# Altium schematic sheet SmartCage.SchDoc: Loadcell Interface
size Legal; ENG_APP_DATE: --/--/--; DSN_APP_DATE: --/--/--; CHK_APP_DATE: --/--/--; DrawnBy: Maxime Tousignant-Tremblay; Organization: DCC/M Lab; DocumentNumber: SC-LI-REV1; Revision: 1; SheetNumber: 1; SheetTotal: 1; Units: mm; Security: CAN UNCLASSIFIED
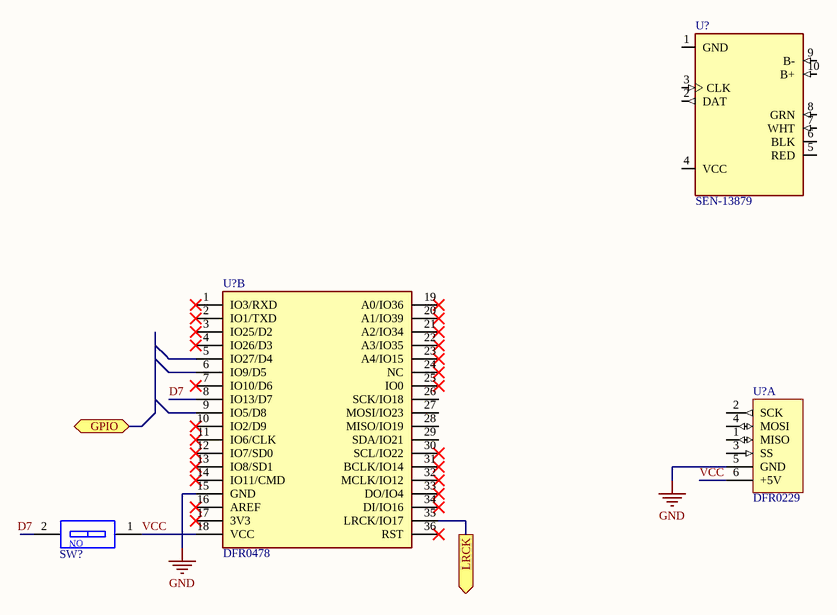
[diagram p0: SmartCage.SchDoc]

## Parts
(Parts that share a designator on the sheet are numbered #1, #2 ... from top to bottom, then left to right.)
SW?  418117270901  [418117270901]  (value not drawn)
U?#1  SEN-13879  [SEN-13879-Footprint-1]
U?#2  DFR0229  [DFR0229-Footprint-1]  (part A of 2)
U?#3  DFR0478  [DFR0478-Footprint-1]  (part B of 2)

## Ports
GPIO (bidir), LRCK (out)

## Nets
GND: U?#2.5(GND) U?#3.15(GND)
D7: SW?.2 U?#3.8(IO13/D7)
LRCK: U?#3.35(LRCK/IO17) ; port LRCK
VCC: SW?.1 U?#2.6(+5V) U?#3.18(VCC)

Not connected (* = marked no-connect by the designer): U?#1 1(GND) 2(DAT) 3(CLK) 4(VCC) 5(RED) 6(BLK) 7(WHT) 8(GRN) 9(B-) 10(B+); U?#2 1(MISO) 2(SCK) 3(SS) 4(MOSI); U?#3 1(IO3/RXD)* 2(IO1/TXD)* 3(IO25/D2)* 4(IO26/D3)* 5(IO27/D4) 6(IO9/D5) 7(IO10/D6)* 9(IO5/D8) 10(IO2/D9)* 11(IO6/CLK)* 12(IO7/SD0)* 13(IO8/SD1)* 14(IO11/CMD)* 16(AREF)* 17(3V3)* 19(A0/IO36)* 20(A1/IO39)* 21(A2/IO34)* 22(A3/IO35)* 23(A4/IO15)* 24(NC)* 25(IO0)* 26(SCK/IO18) 27(MOSI/IO23) 28(MISO/IO19) 29(SDA/IO21) 30(SCL/IO22)* 31(BCLK/IO14)* 32(MCLK/IO12)* 33(DO/IO4)* 34(DI/IO16)* 36(RST)*

## Notes on the sheet
- DRAWN BY
- PROJECT
- DATE
- LAB
- DRAWING NO
- TITLE
- UNITS
- REV
- SHEET
- OF
- (in symbol CMP-011-00014-1) ON

## Library data of the parts
SW? = CMP-011-00014-1: Slide Dip Switch, 1 Switches, SPST, Off-on, Latched, 0.025A, 24VDC, 2 PCB Hole Cnt, Solder Terminal, Through Hole-straight; PCB Hole Count: 2; Insulation Resistance: 100MR; Electrical Life: 5000Cycles; End Contact Plating: Gold; Body Breadth: 3.54inch; End Contact Material: Copper Alloy; Body Height: 5.2mm; Contact Current(DC)-Max: 25mA; Contact Resistance: 0.1mR; Actuator Material: Polyamide; Solderability: WAVE; Number of Switch Sections: 1; Body Length or Diameter: 9.6mm; Actuator Length: 0.043inch; Contact Voltage(DC)-Max: 24V; Actuator Color: White; Body Color: Black; Contact DC Max Rating R Load: .025A@24VDC; Dielectric Withstand Volts: 500VACV; Mounting Technology: Through Hole; Contact Function: Off-On; Reach SVHC Compliant: Yes; Terminal Length: 0.146inch; Housing Material: Polybutylene; Termination: Solder; Terminal Finish: Tin; Contact Material: Copper Alloy; Switch Type: Slide Dip; Packaging: Rail/Tube; Max Operating Temperature: 85°C; RoHS Compliant: Yes; Number of Positions: 1; Center Contact Plating: Gold; JESD-609 Code: e3; Switch Action: LATCHED; Actuator Type: SLIDE; Min Operating Temperature: -40°C; Switch Function: SPST; Insulation Material: Polyamide
U?#1 = CMP-014-00035-3: HX711 Loadcell Amplifier Breakout Boards / Supply Voltage Min. V = 2.7 / Supply Voltage Max. V = 5
U?#2 = CMP-00030-00005-4: Micro Sd Module, Arduino Uno/Mega Rohs Compliant: Yes
U?#3 = CMP-020-00023-4: FireBeetle ESP32 IOT Microcontroller (Supports Wi-Fi & Bluetooth)